# Altium schematic sheet 7SegDisplay.SchDoc
size A4
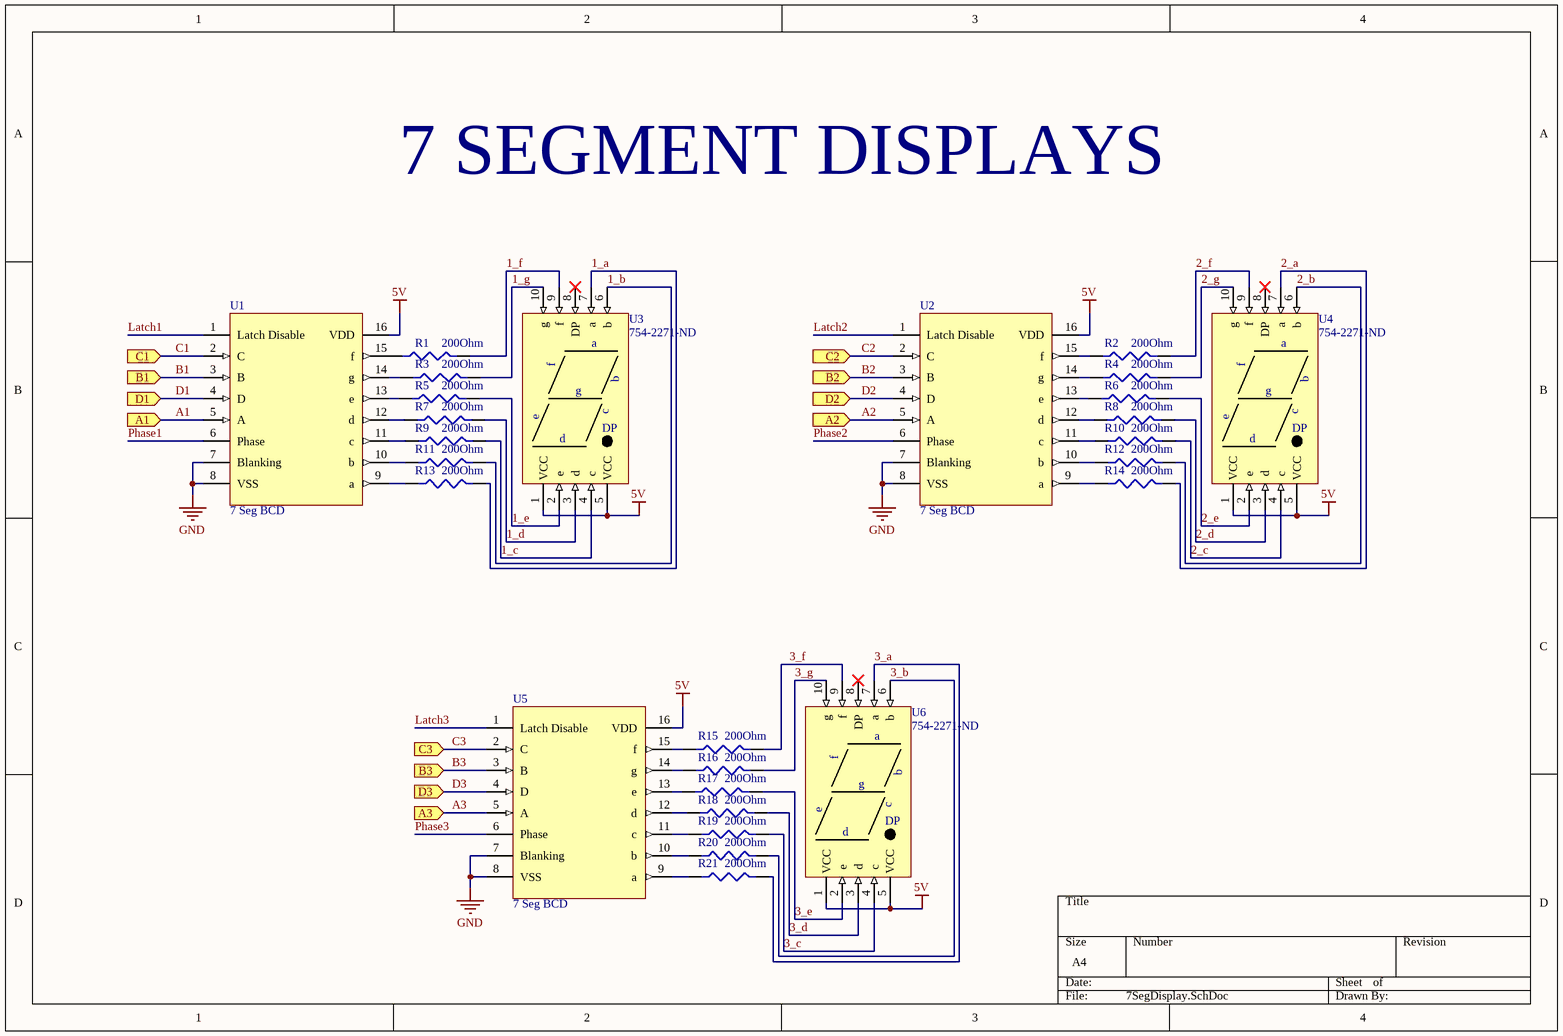
[diagram p0: 7SegDisplay.SchDoc]

## Parts
R1  200Ohm  [RES-0805]
R2  200Ohm  [RES-0805]
R3  200Ohm  [RES-0805]
R4  200Ohm  [RES-0805]
R5  200Ohm  [RES-0805]
R6  200Ohm  [RES-0805]
R7  200Ohm  [RES-0805]
R8  200Ohm  [RES-0805]
R9  200Ohm  [RES-0805]
R10  200Ohm  [RES-0805]
R11  200Ohm  [RES-0805]
R12  200Ohm  [RES-0805]
R13  200Ohm  [RES-0805]
R14  200Ohm  [RES-0805]
R15  200Ohm  [RES-0805]
R16  200Ohm  [RES-0805]
R17  200Ohm  [RES-0805]
R18  200Ohm  [RES-0805]
R19  200Ohm  [RES-0805]
R20  200Ohm  [RES-0805]
R21  200Ohm  [RES-0805]
U1  7 Seg BCD  [TSOP65P640X120-16N]
U2  7 Seg BCD  [TSOP65P640X120-16N]
U3  754-2271-ND  [SA15-11EWA]
U4  754-2271-ND  [SA15-11EWA]
U5  7 Seg BCD  [TSOP65P640X120-16N]
U6  754-2271-ND  [SA15-11EWA]

## Ports
A1 (in), A2 (in), A3 (in), B1 (in), B2 (in), B3 (in), C1 (in), C2 (in), C3 (in), D1 (in), D2 (in), D3 (in)

## Nets
5V: U1.16(VDD) U2.16(VDD) U3.1(VCC) U3.5(VCC) U4.1(VCC) U4.5(VCC) U5.16(VDD) U6.1(VCC) U6.5(VCC)
GND: U1.7(Blanking) U1.8(VSS) U2.7(Blanking) U2.8(VSS) U5.7(Blanking) U5.8(VSS)
1_a: R13.2 U3.7(a)
1_b: R11.2 U3.6(b)
1_c: R9.2 U3.4(c)
1_d: R7.2 U3.3(d)
1_e: R5.2 U3.2(e)
1_f: R1.2 U3.9(f)
1_g: R3.2 U3.10(g)
2_a: R14.2 U4.7(a)
2_b: R12.2 U4.6(b)
2_c: R10.2 U4.4(c)
2_d: R8.2 U4.3(d)
2_e: R6.2 U4.2(e)
2_f: R2.2 U4.9(f)
2_g: R4.2 U4.10(g)
3_a: R21.2 U6.7(a)
3_b: R20.2 U6.6(b)
3_c: R19.2 U6.4(c)
3_d: R18.2 U6.3(d)
3_e: R17.2 U6.2(e)
3_f: R15.2 U6.9(f)
3_g: R16.2 U6.10(g)
A1: U1.5(A) ; port A1
A2: U2.5(A) ; port A2
A3: U5.5(A) ; port A3
B1: U1.3(B) ; port B1
B2: U2.3(B) ; port B2
B3: U5.3(B) ; port B3
C1: U1.2(C) ; port C1
C2: U2.2(C) ; port C2
C3: U5.2(C) ; port C3
D1: U1.4(D) ; port D1
D2: U2.4(D) ; port D2
D3: U5.4(D) ; port D3
Latch1: U1.1(Latch_Disable)
Latch2: U2.1(Latch_Disable)
Latch3: U5.1(Latch_Disable)
Phase1: U1.6(Phase)
Phase2: U2.6(Phase)
Phase3: U5.6(Phase)
NetR1_1: R1.1 U1.15(f)
NetR2_1: R2.1 U2.15(f)
NetR3_1: R3.1 U1.14(g)
NetR4_1: R4.1 U2.14(g)
NetR5_1: R5.1 U1.13(e)
NetR6_1: R6.1 U2.13(e)
NetR7_1: R7.1 U1.12(d)
NetR8_1: R8.1 U2.12(d)
NetR9_1: R9.1 U1.11(c)
NetR10_1: R10.1 U2.11(c)
NetR11_1: R11.1 U1.10(b)
NetR12_1: R12.1 U2.10(b)
NetR13_1: R13.1 U1.9(a)
NetR14_1: R14.1 U2.9(a)
NetR15_1: R15.1 U5.15(f)
NetR16_1: R16.1 U5.14(g)
NetR17_1: R17.1 U5.13(e)
NetR18_1: R18.1 U5.12(d)
NetR19_1: R19.1 U5.11(c)
NetR20_1: R20.1 U5.10(b)
NetR21_1: R21.1 U5.9(a)

Not connected (* = marked no-connect by the designer): U3 8(DP)*; U4 8(DP)*; U6 8(DP)*

## Notes on the sheet
- 7 SEGMENT DISPLAYS

## Library data of the parts
R1-R21 = RNCP0805FTD200R: RES SMD 200 OHM 1% 1/4W 0805; Manufacturer: Stackpole Electronics; Resistance: 200R; Max Power Dissipation: 250mW; Temperature Coefficient: 100ppm/°C; Supplier 1: Digi-Key; Manufacturer Part Number: RNCP0805FTD200R; Stock 1: 80873; Pricing 1: 1=0.10000, 10=0.07200, 100=0.02770, 1000=0.01220, 2500=0.01053 (USD); RoHS: Yes; Mount: Surface Mount; Case/Package: 0805; Case Code (Metric): 2012; Case Code (Imperial): 0805; Min Operating Temperature: -55°C; Max Operating Temperature: 155°C; Packaging: Tape and Reel; Composition: Thin Film; Number of Terminations: 2; Tolerance: 1%; Features: Moisture Resistant,Anti-Sulfur; Length: 0.079inch; Height: 0.024inch; Width: 0.049inch; ComponentLink1URL: http://www.seielect.com/Catalog/SEI-rncp.pdf?src-supplier=Digi-Key; ComponentLink1Description: http://www.seielect.com/Catalog/SEI-rncp.pdf?src-supplier=Digi-Key; ComponentLink2URL: https://www.seielect.com/catalog/SEI-Packaging.pdf?src-supplier=Digi-Key; ComponentLink2Description: https://www.seielect.com/catalog/SEI-Packaging.pdf?src-supplier=Digi-Key; ComponentLink3URL: https://www.seielect.com/Catalog/SEI-rncp.pdf?src-supplier=Avnet; ComponentLink3Description: https://www.seielect.com/Catalog/SEI-rncp.pdf?src-supplier=Avnet; Supplier Part Number 1: RNCP0805FTD200RCT-ND
U1 U2 U5 = CD4543BPWR: IC BCD7SEG LCH/DECD/DRVR 16TSSOP; Manufacturer: Texas Instruments; Number of Inputs: 4; Number of Outputs: 7; Propagation Delay: 400ns; Max Supply Voltage: 18V; Min Supply Voltage: 3V; Number of Elements: 1; Logic Function: Demultiplexer,Decoder; Polarity: Non-Inverting; Turn-On Delay Time: 1200ns; High Level Output Current: -3.33mA; Low Level Output Current: 4.2mA; Quiescent Current: 100uA; Display Type: LCD; Operating Supply Current: 40nA; Bandwidth: 8MHz; Supplier 1: Digi-Key; Manufacturer Part Number: CD4543BPWR; Stock 1: 1809; Pricing 1: 1=0.42000, 10=0.35900, 100=0.26820, 500=0.21074, 1000=0.16284 (USD); RoHS: Yes; Case/Package: TSSOP; Number of Pins: 16; Weight: 0.002183oz; Contact Plating: Gold; Min Operating Temperature: -55°C; Max Operating Temperature: 125°C; Packaging: Tape and Reel; Package Quantity: 1; Min Input Voltage: 3V; Number of Input Lines: 4; Number of Output Lines: 7; Number of Bits: 7; Number of Channels: 4; Lead Free: Lead Free; ComponentLink1URL: https://datasheet.ciiva.com/14294/cd4543b-14294665.pdf?src-supplier=Avnet; ComponentLink1Description: https://datasheet.ciiva.com/14294/cd4543b-14294665.pdf?src-supplier=Avnet; ComponentLink2URL: https://datasheet.ciiva.com/1940/cd4543b-1940490.pdf?src-supplier=Digi-Key; ComponentLink2Description: https://datasheet.ciiva.com/1940/cd4543b-1940490.pdf?src-supplier=Digi-Key; ComponentLink3URL: https://datasheet.ciiva.com/1940/cd4543b-1940491.pdf?src-supplier=Digi-Key; ComponentLink3Description: https://datasheet.ciiva.com/1940/cd4543b-1940491.pdf?src-supplier=Digi-Key; ComponentLink4URL: https://datasheet.ciiva.com/1940/cd4543b-1940492.pdf?src-supplier=Digi-Key; ComponentLink4Description: https://datasheet.ciiva.com/1940/cd4543b-1940492.pdf?src-supplier=Digi-Key; Supplier Part Number 1: 296-17106-1-ND
U3 U4 U6 = SA15-11EWA: DISPLAY, SEVEN SEGMENT, 47MM, RED, COMMON ANODE; Manufacturer: Kingbright; Number of Characters: 1; Max Power Dissipation: 150mW; Forward Current: 30mA; Forward Voltage: 4V; Operating Supply Voltage: 2V; Wavelength: 625nm; Luminous Intensity: 16mcd; Test Current: 20mA; Supplier 1: Digi-Key; Manufacturer Part Number: SA15-11EWA; Stock 1: 760; Pricing 1: 1=3.36000, 10=2.80000, 100=1.96000, 500=1.62400 (USD); RoHS: Yes; Case/Package: DIP; Color: Red; Min Operating Temperature: -40°C; Max Operating Temperature: 85°C; Package Quantity: 15; Packaging: Rail/Tube; Element Configuration: Common Anode; Illumination Color: Red; Height: 1.85inch; Width: 1.306inch; REACH SVHC: No SVHC; ComponentLink1URL: https://datasheet.ciiva.com/2105/sa15-11ewa-2105137.pdf?src-supplier=Digi-Key; ComponentLink1Description: https://datasheet.ciiva.com/2105/sa15-11ewa-2105137.pdf?src-supplier=Digi-Key; ComponentLink2URL: https://datasheet.ciiva.com/4421/sa15-11ewa-49819-4421892.pdf?src-supplier=Mouser; ComponentLink2Description: https://datasheet.ciiva.com/4421/sa15-11ewa-49819-4421892.pdf?src-supplier=Mouser; ComponentLink3URL: https://datasheet.ciiva.com/1230/57137-1230472.pdf?src-supplier=Element14; ComponentLink3Description: https://datasheet.ciiva.com/1230/57137-1230472.pdf?src-supplier=Element14; ComponentLink4URL: https://datasheet.ciiva.com/1230/28421-1230493.pdf?src-supplier=Element14; ComponentLink4Description: https://datasheet.ciiva.com/1230/28421-1230493.pdf?src-supplier=Element14; Supplier Part Number 1: 754-2271-ND